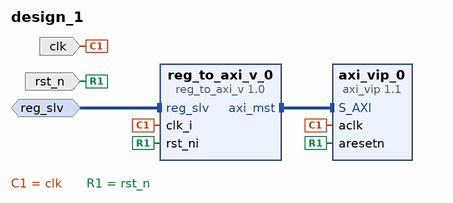
[diagram p0: block diagram of the top level]
# Vivado block design design_1, xczu19eg-ffvc1760-2-i, Vivado 2024.2
create_bd_design design_1

create_bd_intf_port -mode Slave -vlnv user:user:register_interface_rtl:1.0 reg_slv
create_bd_port -dir I clk
create_bd_port -dir I rst_n

create_bd_cell -type ip -vlnv user.org:user:reg_to_axi_v:1.0 reg_to_axi_v_0
create_bd_cell -type ip -vlnv xilinx.com:ip:axi_vip:1.1 axi_vip_0
set_property -dict {CONFIG.ADDR_WIDTH 64 CONFIG.DATA_WIDTH 64 CONFIG.INTERFACE_MODE SLAVE} [get_bd_cells axi_vip_0]

# ---- connections ----

connect_bd_intf_net [get_bd_intf_ports reg_slv] [get_bd_intf_pins reg_to_axi_v_0/reg_slv]
connect_bd_intf_net [get_bd_intf_pins reg_to_axi_v_0/axi_mst] [get_bd_intf_pins axi_vip_0/S_AXI]
connect_bd_net [get_bd_ports clk] [get_bd_pins reg_to_axi_v_0/clk_i] [get_bd_pins axi_vip_0/aclk]
connect_bd_net [get_bd_ports rst_n] [get_bd_pins reg_to_axi_v_0/rst_ni] [get_bd_pins axi_vip_0/aresetn]

# ---- address map ----
assign_bd_address -offset 0x0000 -range 64K -target_address_space [get_bd_addr_spaces reg_to_axi_v_0/axi_mst] [get_bd_addr_segs axi_vip_0/S_AXI/Reg]

validate_bd_design
save_bd_design
